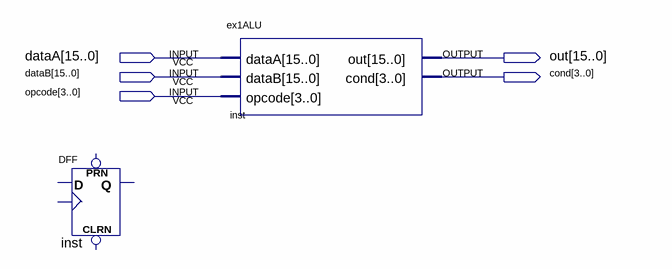
[diagram p0: schematic sheet]
// Quartus schematic seqcircuit.bdf as structural Verilog: 2 symbols, 5 pins
module seqcircuit (
  input  [15:0] dataA,
  input  [15:0] dataB,
  input  [3:0] opcode,
  output [15:0] out,
  output [3:0] cond
);

  DFF inst ();  // open: CLRN, CLK, D, PRN, Q
  ex1ALU inst_dup2 (.dataA(dataA), .dataB(dataB), .opcode(opcode), .out(out), .cond(cond));
endmodule
